# EAGLE board stm v0.7 (EAGLE 9.5.1), part 1 of 2
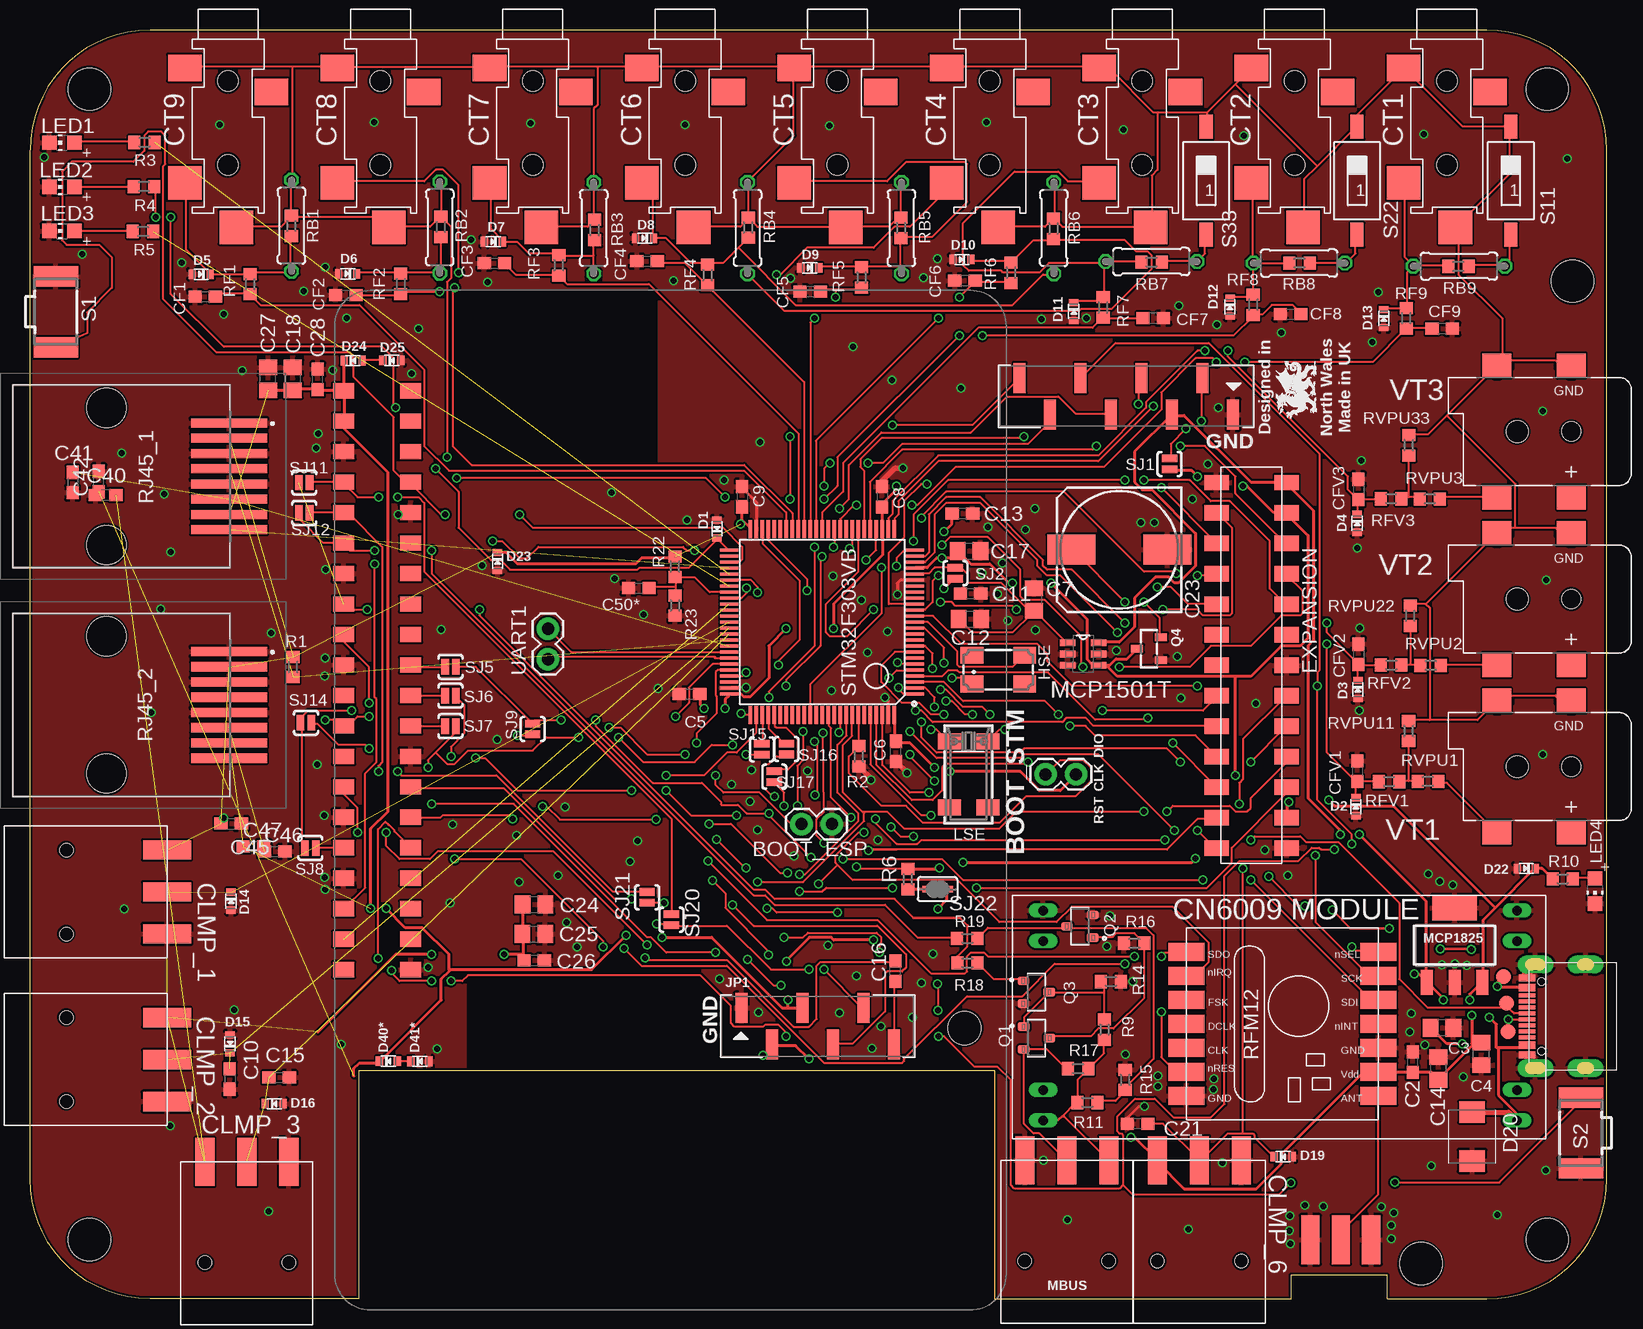
[diagram p5: board, top side]
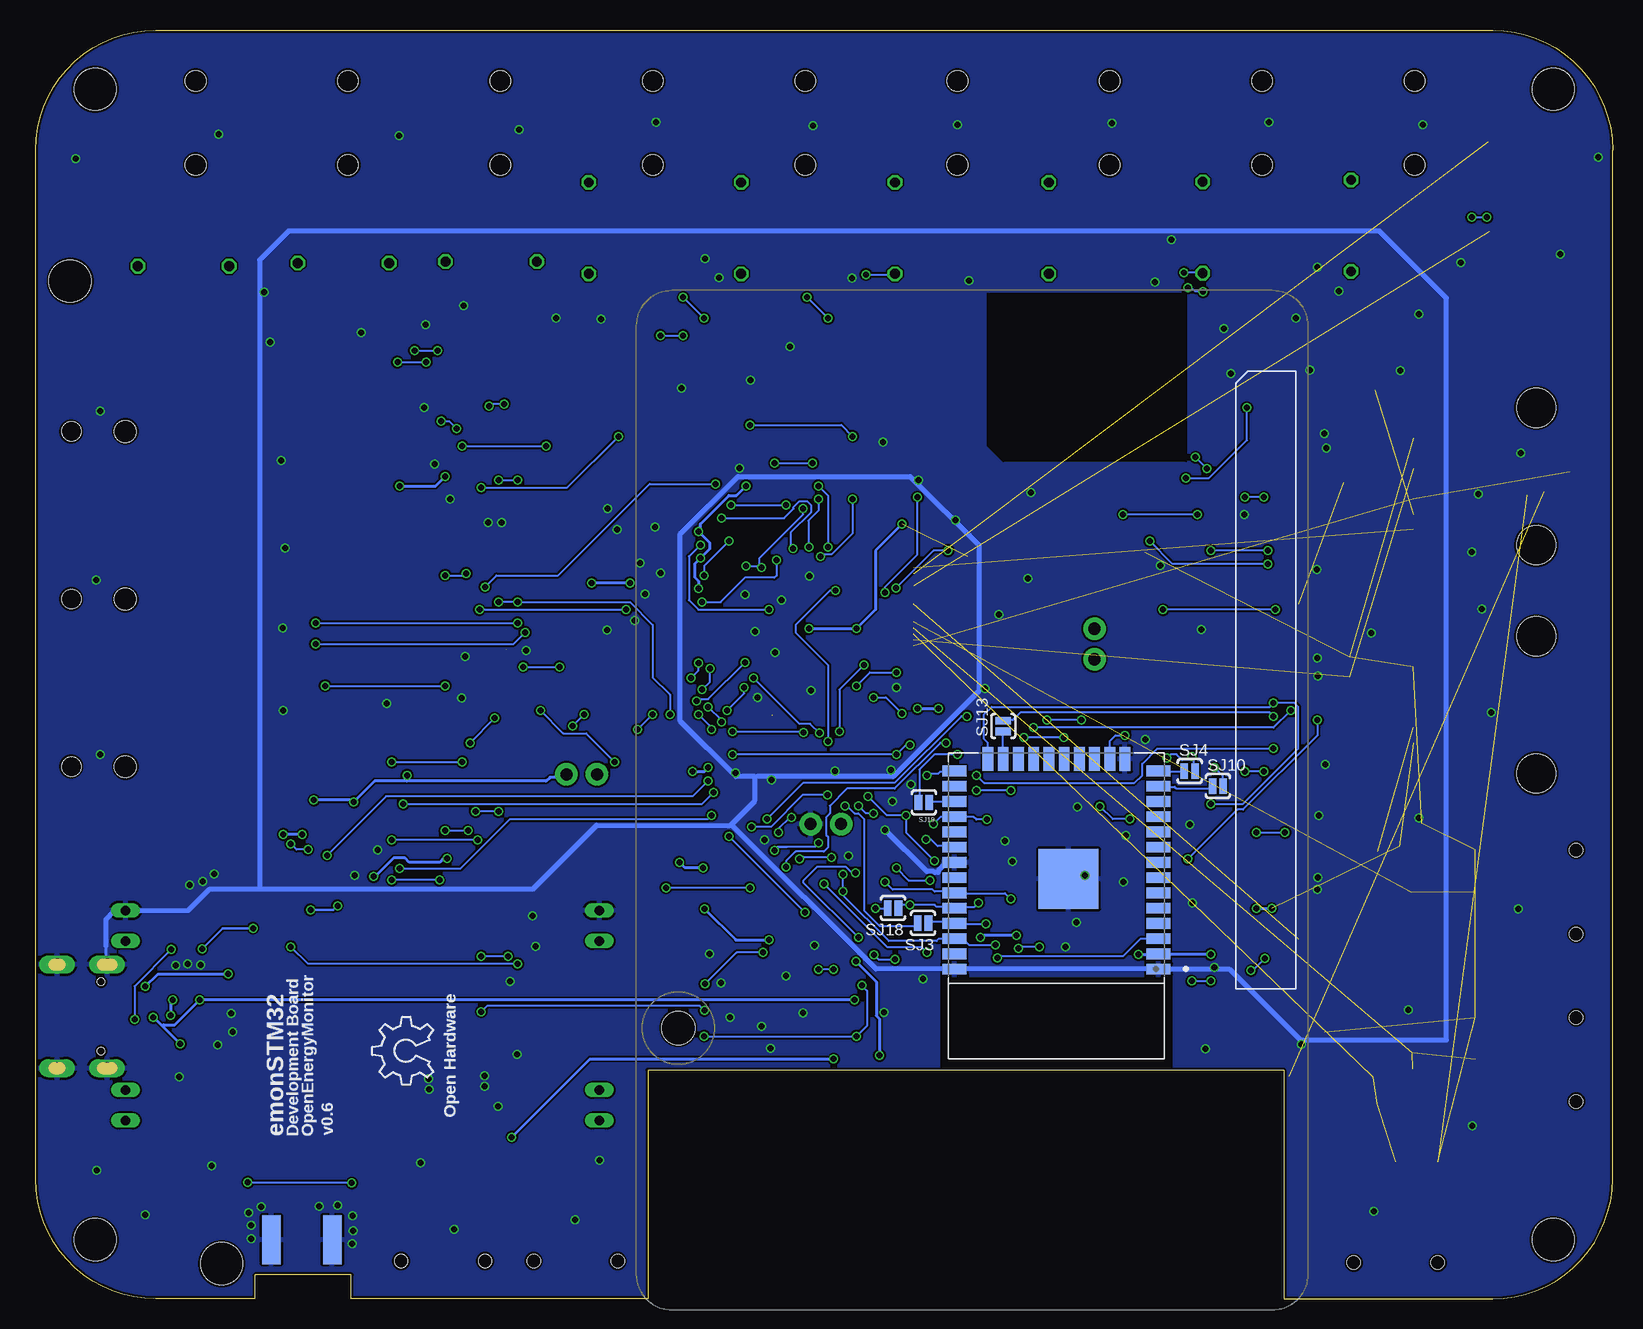
[diagram p6: board, bottom side, seen from below]

Size 131.44 x 105.79 mm. Coordinates in mm from the lower left corner, seen from the top.
Outline: 131.44,10 131.44,95.79 arc90 121.44,105.79 10,105.79 arc90 0,95.79 0,10 arc90 10,0 27.4,0 27.4,19.07 80.41,19.07 80.41,0 105.14,0 105.14,2 113.14,2 113.14,0 121.44,0 arc90 131.44,10
Copper layers (1*16): Top 0.035mm / dielectric 1.53mm / Bottom 0.035mm
Design rules "ragworm": minimum track width 7mil, minimum drill 0.5mm, track to track 6mil, track to pad 6mil, pad to pad 7mil, via to via 8mil, smd to smd 0mil, copper to edge 8mil, drill to drill 10mil, minimum pad ring 3mil, minimum via ring 3mil, stop-mask expansion 2mil, vias tented up to drill 25mil, thermal gap 8mil
Net classes: 0 default: width 0.178 mm, drill 0.5 mm, clearance 0.152 mm; 1 power: width 0.254 mm, drill 0.5 mm, clearance 0.152 mm; 2 gnd: width 0.203 mm, drill 0.5 mm, clearance 0.152 mm
Holes 3.5 mm at 126.49,100.85 4.95,100.85 4.95,4.95 126.49,4.95 128.58,84.85 115.95,2.95
tRestrict: area 36.6,18.4 to 55.9,26.8; area 35.6,69.8 to 52.1,83.8
bRestrict: area 36.7,18.4 to 56,26.8; area 35.6,69.8 to 52.1,83.8

## Footprints (pad centres in the part's own frame; a part is rotated, then mirrored left to right if it is on the bottom)
OMNIMATE_LSF_3_SMT = smd 1.6 x 4: P$1 0,4.2; P$2 3.5,4.2; P$3 7,4.2 | hole 1.1: 0,-4.2; 7,-4.2
1X02 = drill 1.016 pad 1.88: 1 0,0; 2 2.54,0
C0603 = smd 1.1 x 1: 1 -0.85,0; 2 0.85,0
C0805 = smd 1.3 x 1.5: 1 -0.95,0; 2 0.95,0
153CLV-1010 = smd 4 x 2.5: + 4,0; - -4,0
STEREO_SMT = smd 2.8 x 2.2: P$1 -3.6,-2.4; P$3 3.6,-4.4 | smd 2.8 x 2.8: P$2 -3.6,-12; P$4 0.7,-15.7 | hole 1.7: 0,-3.5; 0,-10.5
SOD-523 = smd 0.8 x 0.6: A 0,-0.75; K 0,0.75
SMBJ = smd 1.78 x 2.16: A 2.04,0; C -2.03,0
2X13_SMT = smd 1.27 x 2.032: 1 -15.24,-2.921; 2 -15.24,2.921; 3 -12.7,-2.921; 4 -12.7,2.921; 5 -10.16,-2.921; 6 -10.16,2.921; 7 -7.62,-2.921; 8 -7.62,2.921; 9 -5.08,-2.921; 10 -5.08,2.921; 11 -2.54,-2.921; 12 -2.54,2.921; 13 0,-2.921; 14 0,2.921; 15 2.54,-2.921; 16 2.54,2.921; 17 5.08,-2.921; 18 5.08,2.921; 19 7.62,-2.921; 20 7.62,2.921; 21 10.16,-2.921; 22 10.16,2.921; 23 12.7,-2.921; 24 12.7,2.921; 25 15.24,-2.921; 26 15.24,2.921
CTS406 = smd 1.9 x 1.4: 1 -2.2,-1.2; 2 2.2,-1.2; 3 2.2,1.2; 4 -2.2,1.2
SMA-EDGE = smd 1.524 x 4.064: GND@0 0,0; GND@1 5.08,0; SIG 2.54,0 | smd 1.524 x 4.064 bottom: GND@2 0,0; GND@3 5.08,0
1X06_SMT = smd 1 x 2.5: 1 -6.35,1.52; 2 -3.81,-1.52; 3 -1.27,1.52; 4 1.27,-1.52; 5 3.81,1.52; 6 6.35,-1.52
1X08_SMT = smd 1 x 2.5: 1 -8.89,1.52; 2 -6.35,-1.52; 3 -3.81,1.52; 4 -1.27,-1.52; 5 1.27,1.52; 6 3.81,-1.52; 7 6.35,1.52; 8 8.89,-1.52
CHIP-LED0805 = smd 1.2 x 1.2: A 0,-1.05; C 0,1.05
CRYSTAL_8X3.8 = smd 1.3 x 1.9: P$1 -2.75,-1.6; P$2 2.75,-1.6; P$3 2.75,1.6; P$4 -2.75,1.6
SOT-223 = smd 1 x 2.1: 1 -2.3,-3.1; 2 0,-3.1; 3 2.3,-3.1 | smd 3.7 x 2.1: 4 0,3.1
RPI3MIRROR2 = smd 1.27 x 1.778: P$41 8.371,6.351; P$42 8.371,0.763; P$43 10.911,6.351; P$44 10.911,0.763; P$45 13.451,6.351; P$46 13.451,0.763; P$47 15.991,6.351; P$48 15.991,0.763; P$49 18.531,6.351; P$50 18.531,0.763; P$51 21.071,6.351; P$52 21.071,0.763; P$53 23.611,6.351; P$54 23.611,0.763; P$55 26.151,6.351; P$56 26.151,0.763; P$57 28.691,6.351; P$58 28.691,0.763; P$59 31.231,6.351; P$60 31.231,0.763; P$61 33.771,6.351; P$62 33.771,0.763; P$63 36.311,6.351; P$64 36.311,0.763; P$65 38.851,6.351; P$66 38.851,0.763; P$67 41.391,6.351; P$68 41.391,0.763; P$69 43.931,6.351; P$70 43.931,0.763; P$71 46.471,6.351; P$72 46.471,0.763; P$73 49.011,6.351; P$74 49.011,0.763; P$75 51.551,6.351; P$76 51.551,0.763; P$77 54.091,6.351; P$78 54.091,0.763; P$79 56.631,6.351; P$80 56.631,0.763 | hole 2.75: 61.5,52.505
SOT23 = smd 0.71 x 0.96: 1 -0.95,-1.075; 2 0.95,-1.075; 3 0,1.075
SOT23-R = smd 0.635 x 1.016: 1 -0.95,-1; 2 0.95,-1; 3 0,1
R0603 = smd 1 x 1.1: 1 -0.85,0; 2 0.85,0
0207/7 = drill 0.813 octagon: 1 -3.81,0; 2 3.81,0
RFM12 = smd 1.5 x 3: 1 -5,-10; 2 -3,-10; 3 -1,-10; 4 1,-10; 5 3,-10; 6 5,-10; 7 7,-10; 8 7,6; 9 5,6; 10 3,6; 11 1,6; 12 -1,6; 13 -3,6; 14 -5,6
955016889 = smd 0.76 x 6.35: 1 -4.445,8.975; 2 -3.175,8.975; 3 -1.905,8.975; 4 -0.635,8.975; 5 0.635,8.975; 6 1.905,8.975; 7 3.175,8.975; 8 4.445,8.975 | hole 3.25: -5.715,-1.25; 5.715,-1.25
KSS = smd 1.7 x 3.7: 1 -2.95,0; 2 2.95,0
SMS-001 = smd 1.092 x 2.007: 1 0,-4.496; 2 0,4.496
SJ_2S-NO = smd 0.635 x 1.27: 1 -0.45,0; 2 0.45,0
SJ-CON = smd 1.016 x 0.508: 1 -0.762,0; 2 0.762,0
TQFP100 = smd 0.27 x 1.5: 1 -6,-7.75; 2 -5.5,-7.75; 3 -5,-7.75; 4 -4.5,-7.75; 5 -4,-7.75; 6 -3.5,-7.75; 7 -3,-7.75; 8 -2.5,-7.75; 9 -2,-7.75; 10 -1.5,-7.75; 11 -1,-7.75; 12 -0.5,-7.75; 13 0,-7.75; 14 0.5,-7.75; 15 1,-7.75; 16 1.5,-7.75; 17 2,-7.75; 18 2.5,-7.75; 19 3,-7.75; 20 3.5,-7.75; 21 4,-7.75; 22 4.5,-7.75; 23 5,-7.75; 24 5.5,-7.75; 25 6,-7.75; 51 6,7.75; 52 5.5,7.75; 53 5,7.75; 54 4.5,7.75; 55 4,7.75; 56 3.5,7.75; 57 3,7.75; 58 2.5,7.75; 59 2,7.75; 60 1.5,7.75; 61 1,7.75; 62 0.5,7.75; 63 0,7.75; 64 -0.5,7.75; 65 -1,7.75; 66 -1.5,7.75; 67 -2,7.75; 68 -2.5,7.75; 69 -3,7.75; 70 -3.5,7.75; 71 -4,7.75; 72 -4.5,7.75; 73 -5,7.75; 74 -5.5,7.75; 75 -6,7.75 | smd 1.5 x 0.27: 26 7.75,-6; 27 7.75,-5.5; 28 7.75,-5; 29 7.75,-4.5; 30 7.75,-4; 31 7.75,-3.5; 32 7.75,-3; 33 7.75,-2.5; 34 7.75,-2; 35 7.75,-1.5; 36 7.75,-1; 37 7.75,-0.5; 38 7.75,0; 39 7.75,0.5; 40 7.75,1; 41 7.75,1.5; 42 7.75,2; 43 7.75,2.5; 44 7.75,3; 45 7.75,3.5; 46 7.75,4; 47 7.75,4.5; 48 7.75,5; 49 7.75,5.5; 50 7.75,6; 76 -7.75,6; 77 -7.75,5.5; 78 -7.75,5; 79 -7.75,4.5; 80 -7.75,4; 81 -7.75,3.5; 82 -7.75,3; 83 -7.75,2.5; 84 -7.75,2; 85 -7.75,1.5; 86 -7.75,1; 87 -7.75,0.5; 88 -7.75,0; 89 -7.75,-0.5; 90 -7.75,-1; 91 -7.75,-1.5; 92 -7.75,-2; 93 -7.75,-2.5; 94 -7.75,-3; 95 -7.75,-3.5; 96 -7.75,-4; 97 -7.75,-4.5; 98 -7.75,-5; 99 -7.75,-5.5; 100 -7.75,-6
B1,27 = smd 1.27 x 1.27: TP 0,0
MODULE_ESP32-WROOM-32D = smd 2 x 0.9: 1 -8.5,5.26; 2 -8.5,3.99; 3 -8.5,2.72; 4 -8.5,1.45; 5 -8.5,0.18; 6 -8.5,-1.09; 7 -8.5,-2.36; 8 -8.5,-3.63; 9 -8.5,-4.9; 10 -8.5,-6.17; 11 -8.5,-7.44; 12 -8.5,-8.71; 13 -8.5,-9.98; 14 -8.5,-11.25; 25 8.5,-11.25; 26 8.5,-9.98; 27 8.5,-8.71; 28 8.5,-7.44; 29 8.5,-6.17; 30 8.5,-4.9; 31 8.5,-3.63; 32 8.5,-2.36; 33 8.5,-1.09; 34 8.5,0.18; 35 8.5,1.45; 36 8.5,2.72; 37 8.5,3.99; 38 8.5,5.26 | smd 0.9 x 2: 15 -5.715,-12.25; 16 -4.445,-12.25; 17 -3.175,-12.25; 18 -1.905,-12.25; 19 -0.635,-12.25; 20 0.635,-12.25; 21 1.905,-12.25; 22 3.175,-12.25; 23 4.445,-12.25; 24 5.715,-12.25 | smd 5 x 5: 39 -1,-2.24
BOOST = drill 0.8 long: IN+ 17.5,39.5; IN+1 14.96,39.5; OUT+ 17.5,0; OUT+1 14.96,0; P$1 0,0; P$2 0,39.5; P$3 2.54,39.5; P$4 2.54,0
USB-C = smd 0.6 x 1.4: A1/B12 -3.2,0.7; A4/B9 -2.4,0.7; B1/A12 3.2,0.7; B4/A9 2.4,0.7 | smd 0.3 x 1.4: A5 -1.25,0.7; A6 -0.25,0.7; A7 0.25,0.7; A8 1.25,0.7; B5 1.75,0.7; B6 0.75,0.7; B7 -0.75,0.7; B8 -1.75,0.7 | drill 1 pad 1.2 long: GND1 -4.32,0; GND2 4.33,0; GND3 4.33,-4.18; GND4 -4.32,-4.18 | hole 0.6: -2.89,-0.5; 2.89,-0.5
SOT95P280X145-6N = smd 1.27 x 0.559: 1 -1.295,0.94; 2 -1.295,0; 3 -1.295,-0.94; 4 1.295,-0.94; 5 1.295,0; 6 1.295,0.94
DCJACK_2MM_SMT = smd 2.4 x 2: GND 0,-5.5; GNDBREAK 6.2,-5.5; PWR1 0,5.5; PWR2 6.2,5.5 | hole 1.6: 0,0 | hole 1.8: 4.5,0

## Placement (x,y rotation side)
3POLE_1  OMNIMATE_LSF_3COMBICON_SMT_3  [OMNIMATE_LSF_3_SMT]  7.23,37.43 270 top
3POLE_2  OMNIMATE_LSF_3COMBICON_SMT_3  [OMNIMATE_LSF_3_SMT]  7.23,23.46 270 top
3POLE_3  OMNIMATE_LSF_3COMBICON_SMT_3  [OMNIMATE_LSF_3_SMT]  14.58,7.23 0 top
3POLE_6  OMNIMATE_LSF_3COMBICON_SMT_3  [OMNIMATE_LSF_3_SMT]  93.98,7.37 0 top
3POLE_7  OMNIMATE_LSF_3COMBICON_SMT_3  [OMNIMATE_LSF_3_SMT]  82.93,7.37 0 top
BOOT_ESP  [1X02]  66.85,39.6 180 top
BOOT_STM  [1X02]  84.66,43.74 0 top
C2  100nF  [C0603]  115.27,19.75 90 top
C3  4.7uF  [C0805]  117.7,22.6 180 top
C4  4.7uF  [C0805]  120.99,20.44 90 top
C5  100nF  [C0603]  54.98,50.42 0 top
C6  100nF  [C0603]  72.17,45.66 90 top
C7  1uF  [C0805]  83.7,58.31 90 top
C8  100nF  [C0603]  71.03,66.87 270 top
C9  100nF  [C0603]  59.36,66.88 270 top
C10  100nF  [C0603]  16.65,18.35 270 top
C11  10nF  [C0603]  78.4,58.81 0 top
C12  1uF  [C0805]  78.35,56.68 0 top
C13  10nF  [C0603]  77.73,65.49 0 top
C14  1uF  [C0805]  117.41,19.22 90 top
C15  100nF  [C0603]  20.77,18.47 0 top
C16  100nF  [C0603]  72.14,27.34 90 top
C17  1uF  [C0805]  78.28,62.36 0 top
C18  4.7uF  [C0805]  21.91,76.71 90 top
C21  100nF  [C0603]  92.33,14.61 180 top
C23  [153CLV-1010]  90.79,62.46 180 top
C24  4.7uF  [C0805]  42.01,32.88 0 top
C25  4.7uF  [C0805]  42,30.43 0 top
C26  100nF  [C0603]  42.03,28.25 0 top
C27  4.7uF  [C0805]  19.83,76.7 90 top
C28  100nF  [C0603]  23.99,76.66 90 top
C40  100nF  [C0603]  6.31,67.01 180 top
C41  100nF  [C0603]  3.56,68.07 270 top
C42  100nF  [C0603]  5.74,68.15 90 top
C45  100nF  [C0603]  16.77,39.63 0 top
C46  100nF  [C0603]  20.4,37.3 0 top
C47  100nF  [C0603]  18.63,37.72 0 top
C50*  1uF  [C0603]  50.75,59.25 0 top
CF1  100nF  [C0603]  14.61,83.56 0 top
CF2  100nF  [C0603]  26.33,83.69 0 top
CF3  100nF  [C0603]  38.72,86.34 0 top
CF4  100nF  [C0603]  51.44,86.51 0 top
CF5  100nF  [C0603]  65.03,83.99 0 top
CF6  100nF  [C0603]  77.94,84.9 0 top
CF7  100nF  [C0603]  93.63,81.75 180 top
CF8  100nF  [C0603]  105.08,82.1 0 top
CF9  100nF  [C0603]  117.72,80.88 180 top
CFV1  100nF  [C0603]  110.64,44 270 top
CFV2  100nF  [C0603]  110.74,53.74 270 top
CFV3  100nF  [C0603]  110.74,67.49 270 top
CT1  STEREO_SMD  [STEREO_SMT]  118.11,105.04 0 top
CT2  STEREO_SMD  [STEREO_SMT]  105.41,105.04 0 top
CT3  STEREO_SMD  [STEREO_SMT]  92.71,105.04 0 top
CT4  STEREO_SMD  [STEREO_SMT]  80.01,105.04 0 top
CT5  STEREO_SMD  [STEREO_SMT]  67.31,105.04 0 top
CT6  STEREO_SMD  [STEREO_SMT]  54.61,105.04 0 top
CT7  STEREO_SMD  [STEREO_SMT]  41.91,105.04 0 top
CT8  STEREO_SMD  [STEREO_SMT]  29.21,105.04 0 top
CT9  STEREO_SMD  [STEREO_SMT]  16.51,105.04 0 top
D1  ESD5Z3.3T1G  [SOD-523]  57.26,64.19 180 top
D2  ESD5Z3.3T1G  [SOD-523]  110.53,41.04 0 top
D3  ESD5Z3.3T1G  [SOD-523]  110.7,50.81 0 top
D4  ESD5Z3.3T1G  [SOD-523]  110.63,64.67 0 top
D5  ESD5Z3.3T1G  [SOD-523]  14.27,85.42 270 top
D6  ESD5Z3.3T1G  [SOD-523]  26.49,85.46 270 top
D7  ESD5Z3.3T1G  [SOD-523]  38.62,88.15 270 top
D8  ESD5Z3.3T1G  [SOD-523]  51.23,88.43 270 top
D9  ESD5Z3.3T1G  [SOD-523]  65,85.96 270 top
D10  ESD5Z3.3T1G  [SOD-523]  77.68,86.65 270 top
D11  ESD5Z3.3T1G  [SOD-523]  87,82.32 0 top
D12  ESD5Z3.3T1G  [SOD-523]  100.03,82.7 0 top
D13  ESD5Z3.3T1G  [SOD-523]  112.85,81.74 0 top
D14  ESD5Z3.3T1G  [SOD-523]  16.76,33.16 0 top
D15  ESD5Z3.3T1G  [SOD-523]  16.67,21.27 180 top
D16  ESD5Z3.3T1G  [SOD-523]  20.36,16.27 90 top
D19  ESD5Z3.3T1G  [SOD-523]  104.45,11.87 90 top
D20  [SMBJ]  120.21,13.55 270 top
D22  ESD5Z3.3T1G  [SOD-523]  124.73,35.88 270 top
D23  ESD5Z3.3T1G  [SOD-523]  38.97,61.49 0 top
D24  ESD5Z3.3T1G  [SOD-523]  26.93,78.23 90 top
D25  ESD5Z3.3T1G  [SOD-523]  30.17,78.24 90 top
D40*  ESD5Z3.3T1G  [SOD-523]  29.88,19.82 90 top
D41*  ESD5Z3.3T1G  [SOD-523]  32.5,19.81 90 top
EXPANSION  TSM-113-01-T-DV  [2X13_SMT]  101.83,52.83 270 top
HSE  8MHZ ~15pFmax  [CTS406]  80.72,52.47 0 top
J$1  SMA_EDGE  [SMA-EDGE]  106.72,4.93 0 top
JP1  [1X06_SMT]  65.66,22.73 0 top
JP3  [1X08_SMT]  91.38,75.25 180 top
LED1  Green 1.85V  [CHIP-LED0805]  2.67,96.39 90 top
LED2  Orange 1.85V  [CHIP-LED0805]  2.67,92.71 90 top
LED3  Red 1.85V  [CHIP-LED0805]  2.67,89.03 90 top
LED4  Green 1.85V  [CHIP-LED0805]  130.46,34.02 180 top
LOGO1  OSHW_LOGO_6MILX0200-NT  [OSHW_6X200_NOTEXT]  98.32,17.86 90 bottom
LSE  32.768kHz  [CRYSTAL_8X3.8]  78.24,43.73 270 top
MCP1825  MCP1825SOT-223-3  [SOT-223]  118.75,29.5 0 top
PCB2  RPI3YA  [RPI3MIRROR2]  25.38,84.09 270 top
Q1  MMBT3906  [SOT23]  83.91,21.75 270 top
Q2  MMBT3904  [SOT23]  87.51,31.07 90 top
Q3  MMBT3904  [SOT23]  83.88,25.58 270 top
Q4  [SOT23-R]  93.28,54.21 90 top
R1  4.7k  [R0603]  21.92,52.69 90 top
R2  10k  [R0603]  69.1,45.24 270 top
R3  220R  [R0603]  9.56,96.42 0 top
R4  220R  [R0603]  9.5,92.74 0 top
R5  220R  [R0603]  9.43,89 0 top
R6  1.5K  [R0603]  73.18,35 90 top
R9  39K  [R0603]  89.57,22.46 270 top
R10  220R  [R0603]  127.77,35.02 180 top
R11  33K  [R0603]  88.15,16.38 180 top
R14  22K  [R0603]  90.11,26.46 180 top
R15  3k3  [R0603]  91.29,18.27 270 top
R16  82R  [R0603]  92.05,29.66 0 top
R17  220K  [R0603]  87.36,19.2 0 top
R18  1K  [R0603]  78.14,28.01 180 top
R19  1K  [R0603]  78.14,30.06 180 top
R22  10k  [R0603]  53.77,61.05 90 top
R23  10k  [R0603]  53.78,57.81 90 top
RB1  22r  [R0603]  21.79,89.46 90 top
RB2  22r  [R0603]  34.25,89.37 90 top
RB3  22r  [R0603]  47.06,89.12 90 top
RB4  22r  [R0603]  59.87,89.31 90 top
RB5  22r  [R0603]  72.61,89.29 90 top
RB6  22r  [R0603]  85.32,89.22 90 top
RB7  22r  [R0603]  93.49,86.43 0 top
RB8  22r  [R0603]  105.82,86.36 0 top
RB9  22r  [R0603]  119.07,86.08 0 top
RB10  22r  [0207/7]  21.8,89.48 90 top
RB11  22r  [0207/7]  34.16,89.33 90 top
RB12  22r  [0207/7]  46.99,89.28 90 top
RB13  22r  [0207/7]  59.82,89.28 90 top
RB14  22r  [0207/7]  72.64,89.28 90 top
RB15  22r  [0207/7]  85.34,89.28 90 top
RB16  22r  [0207/7]  93.47,86.49 0 top
RB17  22r  [0207/7]  105.79,86.36 0 top
RB18  22r  [0207/7]  119.13,86.11 0 top
RF1  330R  [R0603]  18.35,84.6 270 top
RF2  330R  [R0603]  30.9,84.62 270 top
RF3  330R  [R0603]  44.08,86.18 270 top
RF4  330R  [R0603]  56.48,85.36 270 top
RF5  330R  [R0603]  69.32,85.16 270 top
RF6  330R  [R0603]  81.78,85.55 270 top
RF7  330R  [R0603]  89.45,82.65 270 top
RF8  330R  [R0603]  101.96,82.89 270 top
RF9  330R  [R0603]  114.72,81.76 270 top
RFM69HCW  RFM12_SMDSMD  [RFM12]  106.4,23.92 270 top
RFV1  330R  [R0603]  113.29,43.13 180 top
RFV2  330R  [R0603]  113.47,52.85 180 top
RFV3  330R  [R0603]  113.46,66.72 180 top
RJ45_1  95501-6889  [955016889]  7.62,68.58 270 top
RJ45_2  95501-6889  [955016889]  7.62,49.53 270 top
RVPU1  120k  [R0603]  116.54,43.15 0 top
RVPU2  120k  [R0603]  116.76,52.82 0 top
RVPU3  120k  [R0603]  116.69,66.7 180 top
RVPU11  10k  [R0603]  114.92,47.36 90 top
RVPU22  10k  [R0603]  115.06,56.96 90 top
RVPU33  10k  [R0603]  114.93,71.18 90 top
S1  KSS221GLFS  [KSS]  2.16,82.3 270 top
S2  KSS221GLFS  [KSS]  129.29,13.84 90 top
S11  SWS001  [SMS-001]  123.44,93.22 0 top
S22  SWS001  [SMS-001]  110.62,93.22 0 top
S33  SWS001  [SMS-001]  98.04,93.22 0 top
SJ1  SOLDERJUMPERNO  [SJ_2S-NO]  95,69.62 270 top
SJ2  SOLDERJUMPERNO  [SJ_2S-NO]  77.13,60.5 90 top
SJ3  SOLDERJUMPERNO  [SJ_2S-NO]  57.48,31.33 180 bottom
SJ4  SOLDERJUMPERNO  [SJ_2S-NO]  35.25,44.01 0 bottom
SJ5  SOLDERJUMPERNO  [SJ_2S-NO]  35.05,52.7 180 top
SJ6  SOLDERJUMPERNO  [SJ_2S-NO]  35.05,50.29 180 top
SJ7  SOLDERJUMPERNO  [SJ_2S-NO]  35.05,47.75 180 top
SJ8  SOLDERJUMPERNO  [SJ_2S-NO]  23.37,37.59 180 top
SJ9  SOLDERJUMPERNO  [SJ_2S-NO]  41.9,47.52 90 top
SJ10  SOLDERJUMPERNO  [SJ_2S-NO]  32.9,42.76 0 bottom
SJ11  SOLDERJUMPERNO  [SJ_2S-NO]  22.86,68.07 180 top
SJ12  SOLDERJUMPERNO  [SJ_2S-NO]  22.86,65.53 180 top
SJ13  SOLDERJUMPERNO  [SJ_2S-NO]  50.79,47.76 90 bottom
SJ14  SOLDERJUMPERNO  [SJ_2S-NO]  23,48.03 0 top
SJ15  SOLDERJUMPERNO  [SJ_2S-NO]  61,45.83 270 top
SJ16  SOLDERJUMPERNO  [SJ_2S-NO]  63.06,45.85 270 top
SJ17  SOLDERJUMPERNO  [SJ_2S-NO]  62.05,43.54 270 top
SJ18  SOLDERJUMPERNO  [SJ_2S-NO]  59.98,32.59 180 bottom
SJ19  SOLDERJUMPERNO  [SJ_2S-NO]  57.4,41.4 180 bottom
SJ20  SOLDERJUMPERNO  [SJ_2S-NO]  53.47,31.62 270 top
SJ21  SOLDERJUMPERNO  [SJ_2S-NO]  51.44,33.49 270 top
SJ22  [SJ-CON]  75.65,34.16 180 top
STM32F303VB  STM32F303XB  [TQFP100]  66.04,56.44 90 top
TP4  TPB1,27  [B1,27]  122.82,26.89 0 top
TP5  TPB1,27  [B1,27]  123.2,22.27 0 top
TP6  TPB1,27  [B1,27]  123.07,24.66 0 top
U1  ESP32-WROOM-32D  [MODULE_ESP32-WROOM-32D]  46.35,32.77 180 bottom
U$2  BOOST_MODULE  [BOOST]  84.45,32.38 270 top
UART1  [1X02]  43.18,53.34 90 top
USB-C  CSP-USC16-TR  [USB-C]  125.49,23.56 90 top
VREF_3V3  MCP1501T-33E  [SOT95P280X145-6N]  87.79,53.78 0 top
VT1  2.1MMJACKSMT  [DCJACK_2MM_SMT]  128.48,44.38 180 top
VT2  2.1MMJACKSMT  [DCJACK_2MM_SMT]  128.48,58.35 180 top
VT3  2.1MMJACKSMT  [DCJACK_2MM_SMT]  128.48,72.32 180 top